# EAGLE board MBEC8_DEBUG (EAGLE 5.10), part 1 of 2
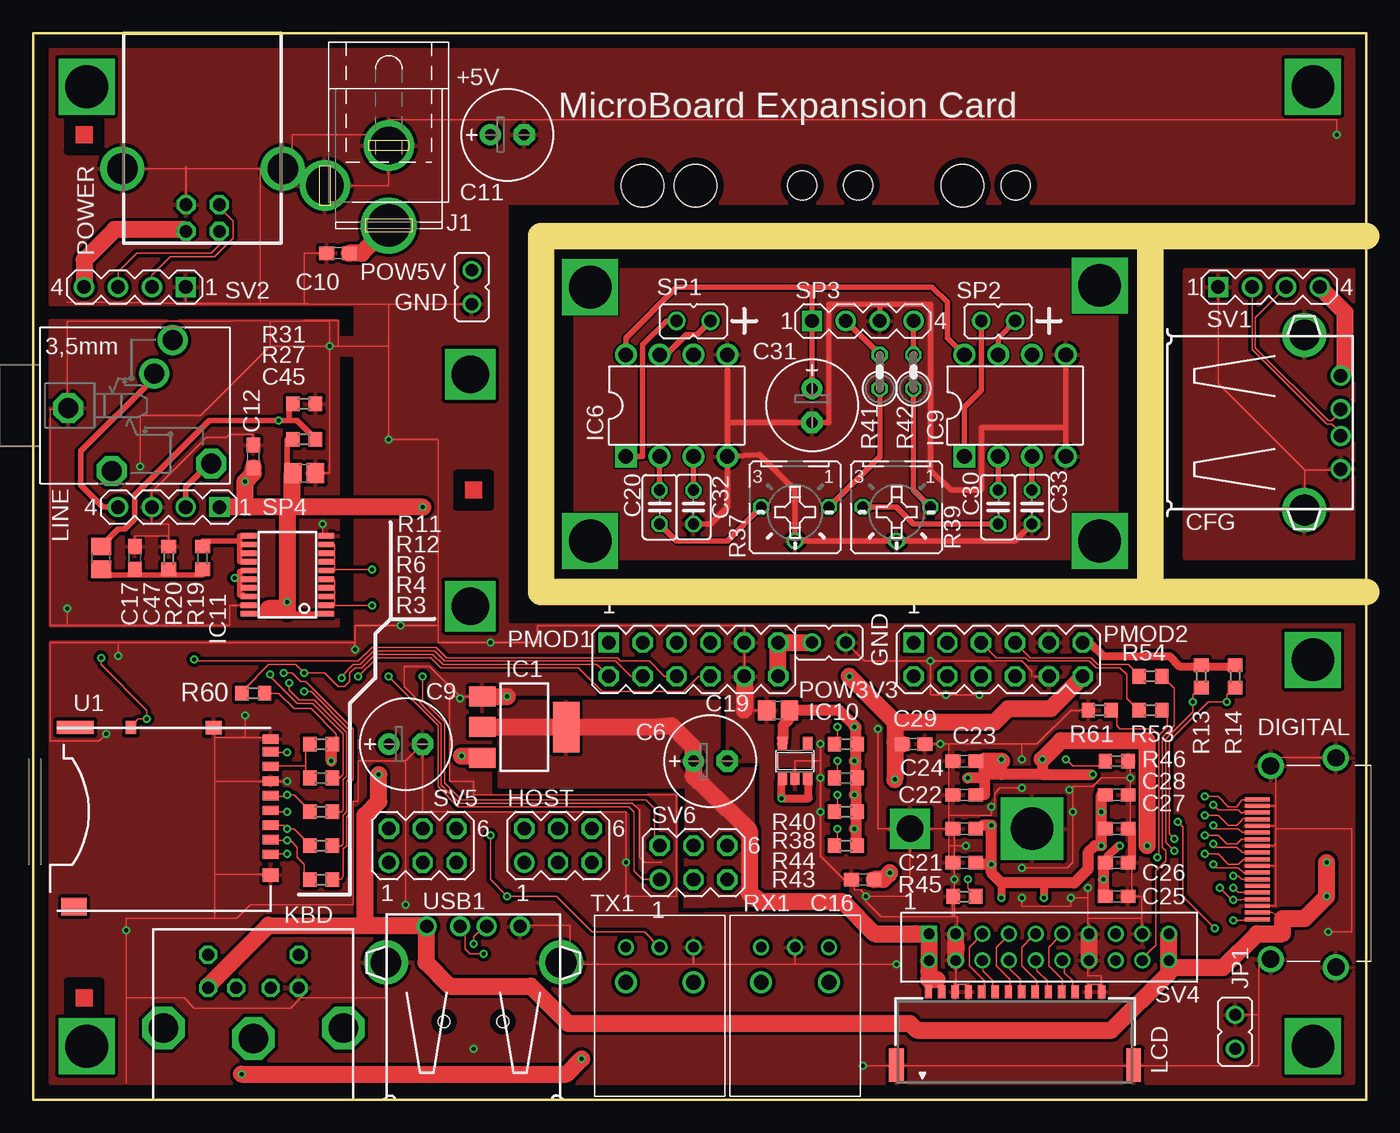
[diagram p2: board, top side]
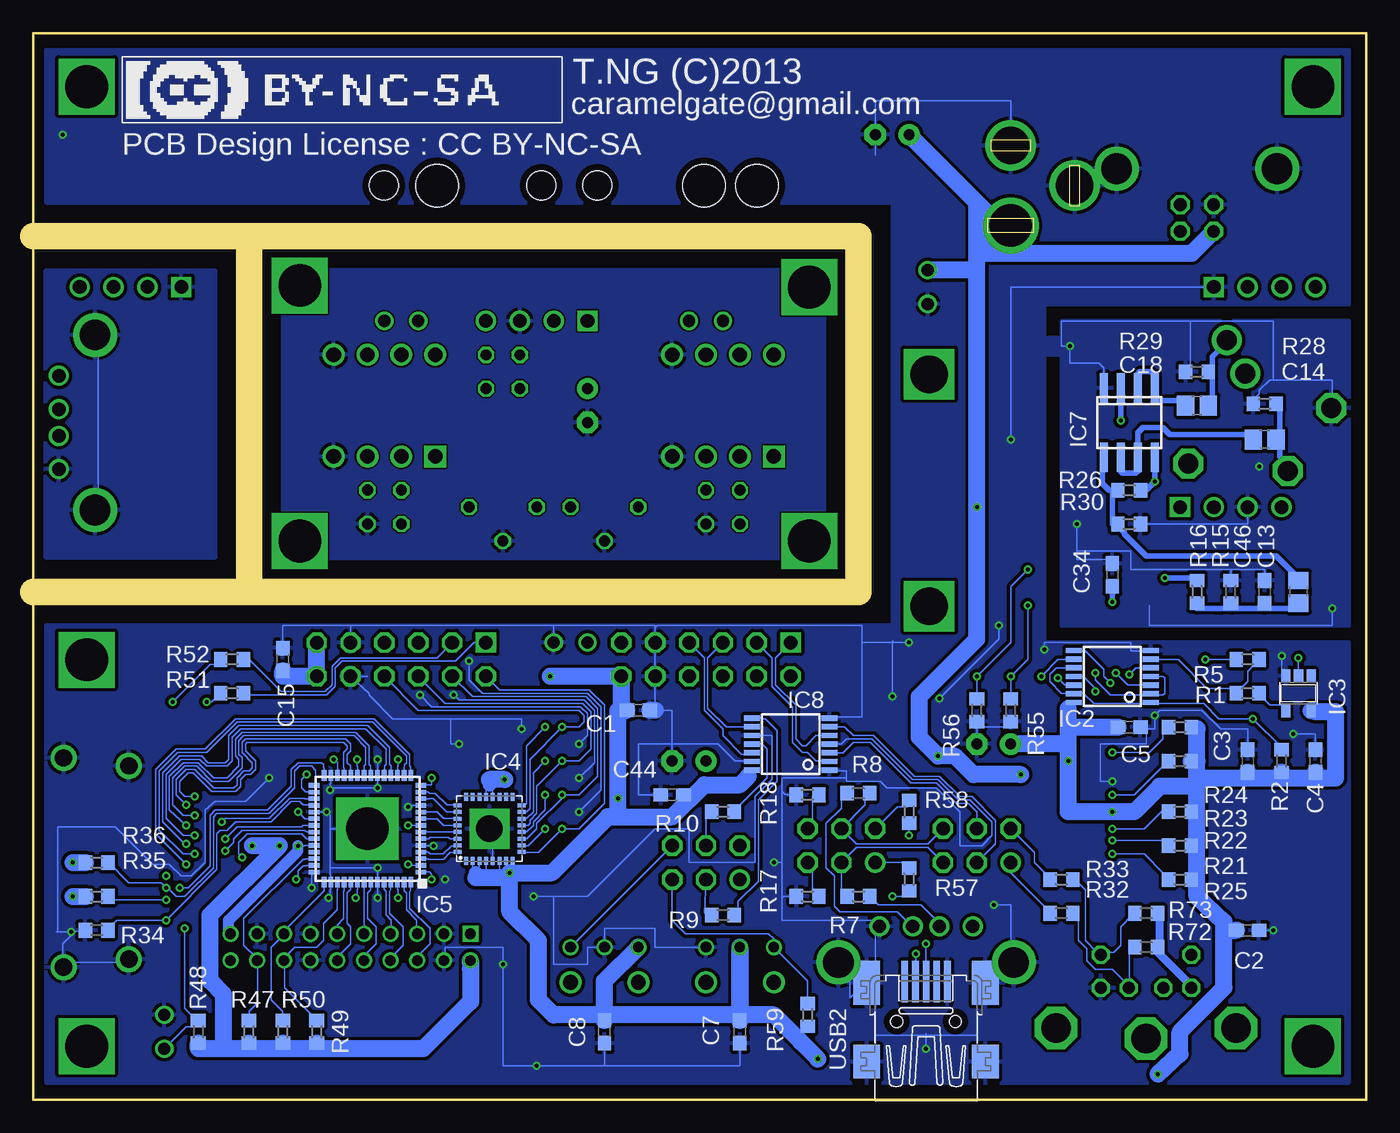
[diagram p3: board, bottom side, seen from below]

Size 100 x 80 mm. Coordinates in mm from the lower left corner, seen from the top.
Outline: 100,38.1 100,0 0,0 0,80 100,80 100,64.77
Outline: 100,38.1 100,64.77
Outline: 83.82,38.1 38.1,38.1 38.1,64.77 83.82,64.77
Outline: 83.82,38.1 100,38.1
Outline: 83.82,64.77 83.82,38.1
Outline: 83.82,64.77 100,64.77
Copper layers (1*16): Top 0.035mm / dielectric 1.53mm / Bottom 0.035mm
Design rules "pban_5mil-l2 *": minimum track width 5mil, minimum drill 0.3mm, track to track 5mil, track to pad 0.229mm, pad to pad 5mil, via to via 5mil, smd to smd 5mil, copper to edge 0.5mm, drill to drill 0.5mm, minimum pad ring 0.15mm, minimum via ring 0.15mm, stop-mask expansion 4mil, vias tented up to drill 0.35mm, thermal gap 10mil
Holes 3.2 mm at 45.69,68.58 49.69,68.58 69.69,68.58
Holes 2.2 mm at 61.89,68.58 73.69,68.58 57.69,68.58
tRestrict: area 31.7,44.5 to 34.3,47; area 2.5,71.1 to 5.1,73.7; area 2.5,6.3 to 5.1,8.9

## Footprints (pad centres in the part's own frame; a part is rotated, then mirrored left to right if it is on the bottom)
C1608 = smd 1.1 x 1: 1 -0.85,0; 2 0.85,0
E2,5-7 = drill 0.813 pad 1.6 round: + -1.27,0 | drill 0.813 pad 1.6 octagon: - 1.27,0
C2012 = smd 1.3 x 1.5: 1 -0.85,0; 2 0.85,0
C025-025X050 = drill 0.813 octagon: 1 -1.27,0; 2 1.27,0
USB-A = drill 1 round: 1 -3.5,12.99; 2 -1,12.99; 3 1,12.99; 4 3.5,12.99 | drill 2.3 round: P$1 -6.57,10.28; P$2 6.57,10.28
HDMI-FCI-A-UPDATE = smd 0.3 x 1.9: 1 4.75,8.5; 2 4.25,8.5; 3 3.75,8.5; 4 3.25,8.5; 5 2.75,8.5; 6 2.25,8.5; 7 1.75,8.5; 8 1.25,8.5; 9 0.75,8.5; 10 0.25,8.5; 11 -0.25,8.5; 12 -0.75,8.5; 13 -1.25,8.5; 14 -1.75,8.5; 15 -2.25,8.5; 16 -2.75,8.5; 17 -3.25,8.5; 18 -3.75,8.5; 19 -4.25,8.5 | drill 1.3 round: 20 -7.85,2.6; 21 7.85,2.6; 22 -7.25,7.5; 23 7.25,7.5
MA03-2 = drill 1.016 round: 1 -2.54,-1.27 | drill 1.016 octagon: 2 -2.54,1.27; 3 0,-1.27; 4 0,1.27; 5 2.54,-1.27; 6 2.54,1.27
SOT223 = smd 1.5 x 2: 1 -2.3,-3.15; 2 0,-3.15; 3 2.3,-3.15 | smd 3.8 x 2: 4 0,3.15
PW_R-PDSO-G14 = smd 0.4 x 1.2: 1 -1.95,-2.9; 2 -1.3,-2.9; 3 -0.65,-2.9; 4 0,-2.9; 5 0.65,-2.9; 6 1.3,-2.9; 7 1.95,-2.9; 8 1.95,2.9; 9 1.3,2.9; 10 0.65,2.9; 11 0,2.9; 12 -0.65,2.9; 13 -1.3,2.9; 14 -1.95,2.9
SOT23-5 = smd 0.69 x 0.99: 1 -0.95,-1.29; 2 0,-1.29; 3 0.95,-1.29; 4 0.95,1.3; 5 -0.95,1.3
QFN32A = smd 0.6 x 0.3: 1 -2.4,1.75; 2 -2.4,1.25; 3 -2.4,0.75; 4 -2.4,0.25; 5 -2.4,-0.25; 6 -2.4,-0.75; 7 -2.4,-1.25; 8 -2.4,-1.75; 17 2.4,-1.75; 18 2.4,-1.25; 19 2.4,-0.75; 20 2.4,-0.25; 21 2.4,0.25; 22 2.4,0.75; 23 2.4,1.25; 24 2.4,1.75 | smd 0.3 x 0.6: 9 -1.75,-2.4; 10 -1.25,-2.4; 11 -0.75,-2.4; 12 -0.25,-2.4; 13 0.25,-2.4; 14 0.75,-2.4; 15 1.25,-2.4; 16 1.75,-2.4; 25 1.75,2.4; 26 1.25,2.4; 27 0.75,2.4; 28 0.25,2.4; 29 -0.25,2.4; 30 -0.75,2.4; 31 -1.25,2.4; 32 -1.75,2.4 | drill 2 square: EXP 0,0
QFN56A = smd 0.8 x 0.35: 1 -4,3.25; 2 -4,2.75; 3 -4,2.25; 4 -4,1.75; 5 -4,1.25; 6 -4,0.75; 7 -4,0.25; 8 -4,-0.25; 9 -4,-0.75; 10 -4,-1.25; 11 -4,-1.75; 12 -4,-2.25; 13 -4,-2.75; 14 -4,-3.25; 29 4,-3.25; 30 4,-2.75; 31 4,-2.25; 32 4,-1.75; 33 4,-1.25; 34 4,-0.75; 35 4,-0.25; 36 4,0.25; 37 4,0.75; 38 4,1.25; 39 4,1.75; 40 4,2.25; 41 4,2.75; 42 4,3.25 | smd 0.35 x 0.8: 15 -3.25,-4; 16 -2.75,-4; 17 -2.25,-4; 18 -1.75,-4; 19 -1.25,-4; 20 -0.75,-4; 21 -0.25,-4; 22 0.25,-4; 23 0.75,-4; 24 1.25,-4; 25 1.75,-4; 26 2.25,-4; 27 2.75,-4; 28 3.25,-4; 43 3.25,4; 44 2.75,4; 45 2.25,4; 46 1.75,4; 47 1.25,4; 48 0.75,4; 49 0.25,4; 50 -0.25,4; 51 -0.75,4; 52 -1.25,4; 53 -1.75,4; 54 -2.25,4; 55 -2.75,4; 56 -3.25,4 | drill 3.2 pad 4.7 square: EXP 0,0
DIL8A = drill 1.1 square: 1 -3.81,-3.81 | drill 1.1 round: 2 -1.27,-3.81; 3 1.27,-3.81; 4 3.81,-3.81; 5 3.81,3.81; 6 1.27,3.81; 7 -1.27,3.81; 8 -3.81,3.81
SO08 = smd 0.6 x 2.2: 1 -1.905,-2.6; 2 -0.635,-2.6; 3 0.635,-2.6; 4 1.905,-2.6; 5 1.905,2.6; 6 0.635,2.6; 7 -0.635,2.6; 8 -1.905,2.6
PW_R-PDSO-G20 = smd 0.4 x 1.2: 1 -2.925,-2.9; 2 -2.275,-2.9; 3 -1.625,-2.9; 4 -0.975,-2.9; 5 -0.325,-2.9; 6 0.325,-2.9; 7 0.975,-2.9; 8 1.625,-2.9; 9 2.275,-2.9; 10 2.925,-2.9; 11 2.925,2.9; 12 2.275,2.9; 13 1.625,2.9; 14 0.975,2.9; 15 0.325,2.9; 16 -0.325,2.9; 17 -0.975,2.9; 18 -1.625,2.9; 19 -2.275,2.9; 20 -2.925,2.9
SPC4077A = drill 2.8 round: 1 -3,0; 2 0,-4.8 | drill 3.2 round: 3 3,0
JP1A = drill 0.914 round: 1 0,-1.27; 2 0,1.27
MDIN06SSA = drill 0.9 octagon: 1 1.3,8.5; 2 -1.3,8.5; 3 3.4,8.5; 4 -3.4,8.5; 5 3.4,11; 6 -3.4,11 | drill 2.2 octagon: P$1 -6.75,5.5; P$2 6.75,5.5; P$3 0,4.7
DF19G-14P-1H = smd 0.55 x 1: 1 -6.5,3; 2 -5.5,3; 3 -4.5,3; 4 -3.5,3; 5 -2.5,3; 6 -1.5,3; 7 -0.5,3; 8 0.5,3; 9 1.5,3; 10 2.5,3; 11 3.5,3; 12 4.5,3; 13 5.5,3; 14 6.5,3 | smd 1.1 x 2.5: FG1 -8.9,-2.5; FG2 8.9,-2.5
PG203JA = drill 1.499 octagon: 1 -5.004,-0.203; 4 5.74,-4.369; 5 -1.753,-4.902 | drill 1.499 round: 2 2.845,4.902; 3 1.448,2.388
MA06-2P = drill 1.016 pad 1.422 square: 1 -6.35,1.27 | drill 1.016 pad 1.422 octagon: 2 -6.35,-1.27; 3 -3.81,1.27; 4 -3.81,-1.27; 5 -1.27,1.27; 6 -1.27,-1.27; 7 1.27,1.27; 8 1.27,-1.27; 9 3.81,1.27; 10 3.81,-1.27; 11 6.35,1.27; 12 6.35,-1.27
PN61729-SA = drill 0.95 octagon: 1 1.25,4.71; 2 -1.25,4.71; 3 -1.25,2.71; 4 1.25,2.71 | drill 2.3 pad 2.9 round: S1 -6.02,0; S2 6.02,0
R0603 = smd 1 x 1.1: 1 -0.85,0; 2 0.85,0
B25P = drill 0.813 octagon: A -2.54,0; E 2.54,0; S 0,2.54
0207/2V = drill 0.813 octagon: 1 -1.27,0; 2 1.27,0
PL_13X/T10 = drill 0.8 round: 1 2.54,0; 2 0,0; 3 -2.54,0 | drill 1.1 round: 4 2.54,2.63; 5 -2.54,2.63
MA04-1A = drill 1.016 square: 1 -3.81,0 | drill 1.016 round: 2 -1.27,0; 3 1.27,0; 4 3.81,0
MA10-2S = drill 0.8 square: 1 -9,1 | drill 0.8 round: 2 -9,-1; 3 -7,1; 4 -7,-1; 5 -5,1; 6 -5,-1; 7 -3,1; 8 -3,-1; 9 -1,1; 10 -1,-1; 11 1,1; 12 1,-1; 13 3,1; 14 3,-1; 15 5,1; 16 5,-1; 17 7,1; 18 7,-1; 19 9,1; 20 9,-1
DM3A-SF-PEJ-A = smd 0.7 x 1.2: 1 3.2,16.55; 2 2.1,16.55; 3 1,16.55; 4 -0.1,16.55; 5 -1.2,16.55; 6 -2.3,16.55; 7 -3.4,16.55; 8 -4.5,16.55; CD1 -5.45,16.55 | smd 1 x 0.8: CD2 -6.325,6.05 | smd 1 x 1.2: GND1 4.75,16.55; GND2 -6.3,12.25 | smd 1 x 2.8: GND3 -6.325,1.875 | smd 1.3 x 1.9: GND4 7.125,1.775
32005-201 = smd 3.1 x 0.5: 1 3,1.6; 2 3,0.8; 3 3,0; 4 3,-0.8; 5 3,-1.6 | smd 2.5 x 2: M1 -3,-4.45; M2 -3,4.45 | smd 3.3 x 2: M3 2.9,4.45; M4 2.9,-4.45 | hole 0.9: 0,2.2; 0,-2.2

## Placement (x,y rotation side)
C1  0.1u  [C1608]  54.61,29.21 180 bottom
C2  0.1u  [C1608]  8.89,12.7 180 bottom
C3  0.1u  [C1608]  8.89,25.4 270 bottom
C4  0.1u  [C1608]  3.81,25.4 270 bottom
C5  0.1u  [C1608]  17.78,27.94 180 bottom
C6  47uF  [E2,5-7]  50.8,25.4 0 top
C7  0.1u  [C1608]  46.99,5.08 90 bottom
C8  0.1u  [C1608]  57.15,5.08 90 bottom
C9  47uF  [E2,5-7]  27.94,26.67 0 top
C10  0.1u  [C1608]  22.86,63.5 0 top
C11  47uF  [E2,5-7]  35.56,72.39 0 top
C12  0.1u  [C1608]  16.51,48.26 270 top
C13  10u  [C2012]  5.08,38.1 90 bottom
C14  10u  [C2012]  7.62,49.53 0 bottom
C15  0.1u  [C1608]  81.28,33.02 270 bottom
C16  0.1u  [C1608]  62.23,16.51 0 top
C17  10u  [C2012]  5.08,40.64 90 top
C18  10u  [C2012]  12.7,52.07 0 bottom
C19  10u  [C2012]  55.88,29.21 0 top
C20  10uF (WO)  [C025-025X050]  46.99,44.45 90 top
C21  0.1uF  [C1608]  69.85,17.78 180 top
C22  0.1uF  [C1608]  69.85,20.32 180 top
C23  0.1uF  [C1608]  69.85,25.4 180 top
C24  0.1uF  [C1608]  69.85,22.86 180 top
C25  0.1uF  [C1608]  81.28,15.24 0 top
C26  0.1uF  [C1608]  81.28,17.78 0 top
C27  0.1uF  [C1608]  81.28,20.32 0 top
C28  0.1uF  [C1608]  81.28,22.86 0 top
C29  0.1uF  [C1608]  66.04,26.67 0 top
C30  10uF (WO)  [C025-025X050]  72.39,44.45 90 top
C31  47uF (WO)  [E2,5-7]  58.42,52.07 270 top
C32  10uF (WO)  [C025-025X050]  49.53,44.45 270 top
C33  10uF (WO)  [C025-025X050]  74.93,44.45 270 top
C34  0.1u  [C1608]  19.05,39.37 270 bottom
C44  0.1u  [C1608]  52.07,22.86 0 bottom
C45  10u  [C2012]  20.32,46.99 0 top
C46  220p  [C1608]  7.62,38.1 90 bottom
C47  220p  [C1608]  7.62,40.64 90 top
CFG  [USB-A]  85.09,50.8 270 top
DIGITAL  [HDMI-FCI-A-UPDATE]  100.33,17.78 90 top
HOST  [MA03-2]  39.37,19.05 0 top
IC1  LD117AS-A 3V3  [SOT223]  36.83,27.94 270 top
IC2  74125TSSOP  [PW_R-PDSO-G14]  19.05,31.75 90 bottom
IC3  74LVC1G04DBV  [SOT23-5]  5.08,30.48 180 bottom
IC4  DS15BR401  [QFN32A]  65.79,20.32 90 bottom
IC5  SN75DP122-A  [QFN56A]  74.93,20.32 180 bottom
IC6  HT82V739A (WO)  [DIL8A]  48.26,52.07 0 top
IC7  LM358D  [SO08]  17.78,50.8 180 bottom
IC8  74CBT3125TSSOP  [PW_R-PDSO-G14]  43.18,26.67 90 bottom
IC9  HT82V739A (WO)  [DIL8A]  73.66,52.07 0 top
IC10  LP5951 1V5  [SOT23-5]  57.15,25.4 0 top
IC11  74245TSSOP  [PW_R-PDSO-G20]  19.05,39.37 90 top
J1  [SPC4077A]  26.67,68.58 270 top
JP1  [JP1A]  90.17,5.08 180 top
KBD  [MDIN06SSA]  16.51,-0.13 0 top
LCD  DF19-14P  [DF19G-14P-1H]  73.66,5.08 0 top
LINE  AJ1780  [PG203JA]  7.62,52.07 0 top
PMOD1  [MA06-2P]  49.53,33.02 0 top
PMOD2  [MA06-2P]  72.39,33.02 0 top
POW3V3  [JP1A]  59.69,34.29 90 top
POW5V  [JP1A]  32.89,60.96 0 top
POWER  PN61729-SA  [PN61729-SA]  12.7,69.85 180 top
R1  10k  [R0603]  8.89,30.48 180 bottom
R2  10k  [R0603]  6.35,25.4 270 bottom
R3  100  [R0603]  21.59,16.51 180 top
R4  100  [R0603]  21.59,19.05 180 top
R5  100  [R0603]  8.89,33.02 0 bottom
R6  100  [R0603]  21.59,21.59 180 top
R7  22  [R0603]  38.1,15.24 0 bottom
R8  22  [R0603]  38.1,22.99 180 bottom
R9  22  [R0603]  48.26,13.84 180 bottom
R10  22  [R0603]  48.26,21.59 180 bottom
R11  10k  [R0603]  21.59,26.67 0 top
R12  100  [R0603]  21.59,24.13 180 top
R13  10k  [R0603]  87.63,31.75 90 top
R14  10k  [R0603]  90.17,31.75 90 top
R15  1k  [R0603]  10.16,38.1 90 bottom
R16  2.2k  [R0603]  12.7,38.1 270 bottom
R17  15k  [R0603]  41.91,15.24 0 bottom
R18  15k  [R0603]  41.91,22.86 0 bottom
R19  2.2k  [R0603]  12.7,40.64 270 top
R20  1k  [R0603]  10.16,40.64 270 top
R21  10k  [R0603]  13.97,19.05 0 bottom
R22  10k  [R0603]  13.97,21.59 0 bottom
R23  10k  [R0603]  13.97,25.4 0 bottom
R24  10k  [R0603]  13.97,27.94 0 bottom
R25  10k  [R0603]  13.97,16.51 0 bottom
R26  100k  [R0603]  17.78,45.72 0 bottom
R27  100k  [R0603]  20.32,49.53 180 top
R28  56k  [R0603]  7.62,52.2 180 bottom
R29  56k  [R0603]  12.7,54.61 180 bottom
R30  100k  [R0603]  17.78,43.18 180 bottom
R31  100k  [R0603]  20.32,52.2 180 top
R32  100  [R0603]  22.86,13.97 0 bottom
R33  100  [R0603]  22.86,16.51 0 bottom
R34  10k  [R0603]  95.25,12.7 0 bottom
R35  10k  [R0603]  95.25,15.24 180 bottom
R36  10k  [R0603]  95.25,17.78 180 bottom
R37  50k (WO)  [B25P]  57.15,44.45 180 top
R38  50  [R0603]  60.96,24.13 0 top
R39  50k (WO)  [B25P]  64.77,44.45 180 top
R40  50  [R0603]  60.96,26.67 0 top
R41  10k (WO)  [0207/2V]  63.5,54.61 90 top
R42  10k (WO)  [0207/2V]  66.04,54.61 90 top
R43  50  [R0603]  60.96,19.05 0 top
R44  50  [R0603]  60.96,21.59 0 top
R45  6.5k  [R0603]  69.85,15.24 0 top
R46  5.1k  [R0603]  81.28,25.4 0 top
R47  10k  [R0603]  83.82,5.08 270 bottom
R48  10k  [R0603]  87.63,5.08 270 bottom
R49  10k  [R0603]  78.74,5.08 270 bottom
R50  10k  [R0603]  81.28,5.08 270 bottom
R51  100  [R0603]  85.09,30.48 180 bottom
R52  100  [R0603]  85.09,33.02 180 bottom
R53  100  [R0603]  83.82,29.21 0 top
R54  100  [R0603]  83.82,31.75 0 top
R55  10k  [R0603]  26.67,29.21 90 bottom
R56  10k  [R0603]  29.21,29.21 90 bottom
R57  1.5k  [R0603]  34.29,16.51 270 bottom
R58  1.5k  [R0603]  34.29,21.59 270 bottom
R59  1.5k  [R0603]  41.91,6.35 90 bottom
R60  10k  [R0603]  16.51,30.48 0 top
R61  10k  [R0603]  80.01,29.21 0 top
R72  2.2k  [R0603]  16.51,11.43 0 bottom
R73  2.2k  [R0603]  16.51,13.97 0 bottom
RX1  PLR135T10  [PL_13X/T10]  57.15,11.43 180 top
SP1  (WO)  [JP1A]  49.53,58.42 90 top
SP2  (WO)  [JP1A]  72.39,58.42 90 top
SP3  (WO)  [MA04-1A]  62.23,58.42 0 top
SP4  [MA04-1A]  10.16,44.45 180 top
SV1  [MA04-1A]  92.71,60.96 0 top
SV2  [MA04-1A]  7.62,60.96 180 top
SV4  [MA10-2S]  76.2,11.43 0 top
SV5  [MA03-2]  29.21,19.05 0 top
SV6  [MA03-2]  49.53,17.78 0 top
TX1  PLT133T10  [PL_13X/T10]  46.99,11.43 180 top
U1  USD-SOCKETHIROSE-A  [DM3A-SF-PEJ-A]  1.27,21.59 270 top
USB1  [USB-A]  33.02,0 0 top
USB2  MINI-USB-SCHIELD-32005-201  [32005-201]  33.02,5.84 90 bottom